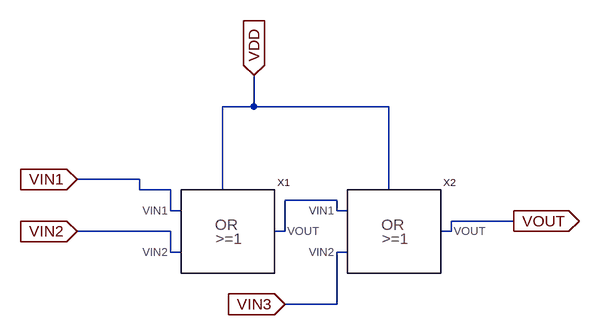
[diagram p0: schematic triple_or.asc]
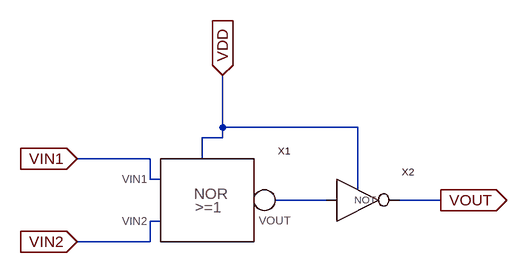
[diagram p1: sub-circuit or.asc]
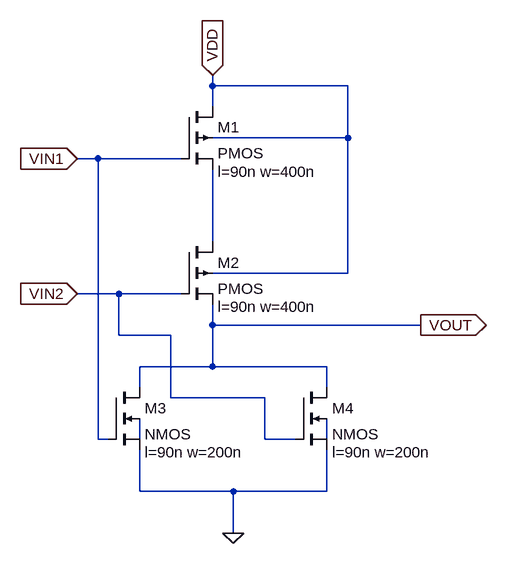
[diagram p2: sub-circuit nor.asc]
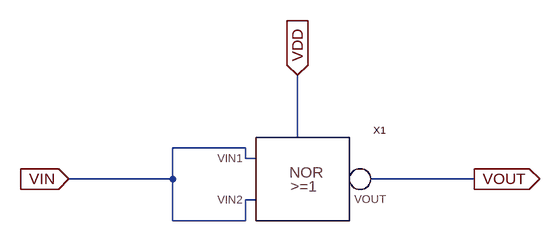
[diagram p3: sub-circuit not.asc]
triple_or.asc, the LTspice schematic file:
Version 4
SHEET 1 936 680
WIRE 448 16 448 -32
WIRE 448 16 400 16
WIRE 656 16 448 16
WIRE 272 128 176 128
WIRE 272 144 272 128
WIRE 320 144 272 144
WIRE 400 144 400 16
WIRE 656 144 656 16
WIRE 576 160 496 160
WIRE 320 176 320 144
WIRE 336 176 320 176
WIRE 576 176 576 160
WIRE 592 176 576 176
WIRE 848 192 752 192
WIRE 320 208 176 208
WIRE 496 208 496 160
WIRE 496 208 480 208
WIRE 752 208 752 192
WIRE 752 208 736 208
WIRE 320 240 320 208
WIRE 336 240 320 240
WIRE 592 240 576 240
WIRE 576 320 576 240
WIRE 576 320 496 320
FLAG 176 128 VIN1
IOPIN 176 128 In
FLAG 176 208 VIN2
IOPIN 176 208 In
FLAG 496 320 VIN3
IOPIN 496 320 In
FLAG 848 192 VOUT
IOPIN 848 192 Out
FLAG 448 -32 VDD
IOPIN 448 -32 In
SYMBOL or 320 176 R0
SYMATTR InstName X1
SYMBOL or 576 176 R0
SYMATTR InstName X2

or.asc, the sub-circuit schematic file:
Version 4
SHEET 1 880 680
WIRE 288 80 288 0
WIRE 496 80 288 80
WIRE 288 96 288 80
WIRE 288 96 256 96
WIRE 176 128 64 128
WIRE 256 128 256 96
WIRE 176 160 176 128
WIRE 192 160 176 160
WIRE 496 176 496 80
WIRE 464 192 368 192
WIRE 624 192 544 192
WIRE 192 224 176 224
WIRE 176 256 176 224
WIRE 176 256 64 256
FLAG 64 128 VIN1
IOPIN 64 128 In
FLAG 64 256 VIN2
IOPIN 64 256 In
FLAG 624 192 VOUT
IOPIN 624 192 Out
FLAG 288 0 VDD
IOPIN 288 0 In
SYMBOL nor 176 160 R0
SYMATTR InstName X1
SYMBOL not 480 192 R0
SYMATTR InstName X2

nor.asc, the sub-circuit schematic file:
Version 4
SHEET 1 880 680
WIRE -32 -64 -32 -80
WIRE 176 -64 -32 -64
WIRE -32 -32 -32 -64
WIRE 176 16 176 -64
WIRE 176 16 -32 16
WIRE -208 48 -240 48
WIRE -80 48 -208 48
WIRE -32 176 -32 64
WIRE 176 224 176 16
WIRE 176 224 -32 224
WIRE -176 256 -240 256
WIRE -80 256 -176 256
WIRE -32 304 -32 272
WIRE 288 304 -32 304
WIRE -176 320 -176 256
WIRE -96 320 -176 320
WIRE -32 368 -32 304
WIRE -32 368 -144 368
WIRE 144 368 -32 368
WIRE -144 400 -144 368
WIRE 144 400 144 368
WIRE -96 416 -96 320
WIRE 48 416 -96 416
WIRE -208 480 -208 48
WIRE -192 480 -208 480
WIRE -144 480 -144 448
WIRE 48 480 48 416
WIRE 96 480 48 480
WIRE 144 480 144 448
WIRE -144 560 -144 496
WIRE 0 560 -144 560
WIRE 144 560 144 496
WIRE 144 560 0 560
WIRE 0 624 0 560
FLAG -32 -80 VDD
IOPIN -32 -80 In
FLAG -240 48 VIN1
IOPIN -240 48 In
FLAG -240 256 VIN2
IOPIN -240 256 In
FLAG 288 304 VOUT
IOPIN 288 304 Out
FLAG 0 624 0
SYMBOL pmos4 -80 -32 R0
WINDOW 123 56 100 Left 2
SYMATTR Value2 l=90n w=400n
SYMATTR InstName M1
SYMBOL pmos4 -80 176 R0
WINDOW 123 56 100 Left 2
SYMATTR Value2 l=90n w=400n
SYMATTR InstName M2
SYMBOL nmos4 -192 400 R0
WINDOW 123 56 100 Left 2
SYMATTR Value2 l=90n w=200n
SYMATTR InstName M3
SYMBOL nmos4 96 400 R0
WINDOW 123 56 100 Left 2
SYMATTR Value2 l=90n w=200n
SYMATTR InstName M4

not.asc, the sub-circuit schematic file:
Version 4
SHEET 1 880 680
WIRE 384 80 384 -16
WIRE 304 96 192 96
WIRE 304 112 304 96
WIRE 320 112 304 112
WIRE 192 144 192 96
WIRE 192 144 32 144
WIRE 656 144 496 144
WIRE 320 176 304 176
WIRE 192 208 192 144
WIRE 304 208 304 176
WIRE 304 208 192 208
FLAG 32 144 VIN
IOPIN 32 144 In
FLAG 384 -16 VDD
IOPIN 384 -16 In
FLAG 656 144 VOUT
IOPIN 656 144 Out
SYMBOL nor 304 112 R0
SYMATTR InstName X1

The netlist it stands for:
* triple_or.asc
XX1 VIN1 VIN2 N001 VDD or
XX2 N001 VIN3 VOUT VDD or

* block symbol definitions
.subckt or VIN1 VIN2 VOUT VDD
XX1 VIN1 VIN2 N001 VDD nor
XX2 N001 VOUT VDD not
.ends or

.subckt nor VIN1 VIN2 VOUT VDD
M1 VDD VIN1 N001 VDD PMOS l=90n w=400n
M2 N001 VIN2 VOUT VDD PMOS l=90n w=400n
M3 VOUT VIN1 0 N002 NMOS l=90n w=200n
M4 VOUT VIN2 0 N003 NMOS l=90n w=200n
.ends nor

.subckt not VIN VOUT VDD
XX1 VIN VIN VOUT VDD nor
.ends not

.model NMOS NMOS
.model PMOS PMOS
.lib standard.mos
.backanno
.end